# EAGLE design motor Controller4 (EAGLE 9.6.2)
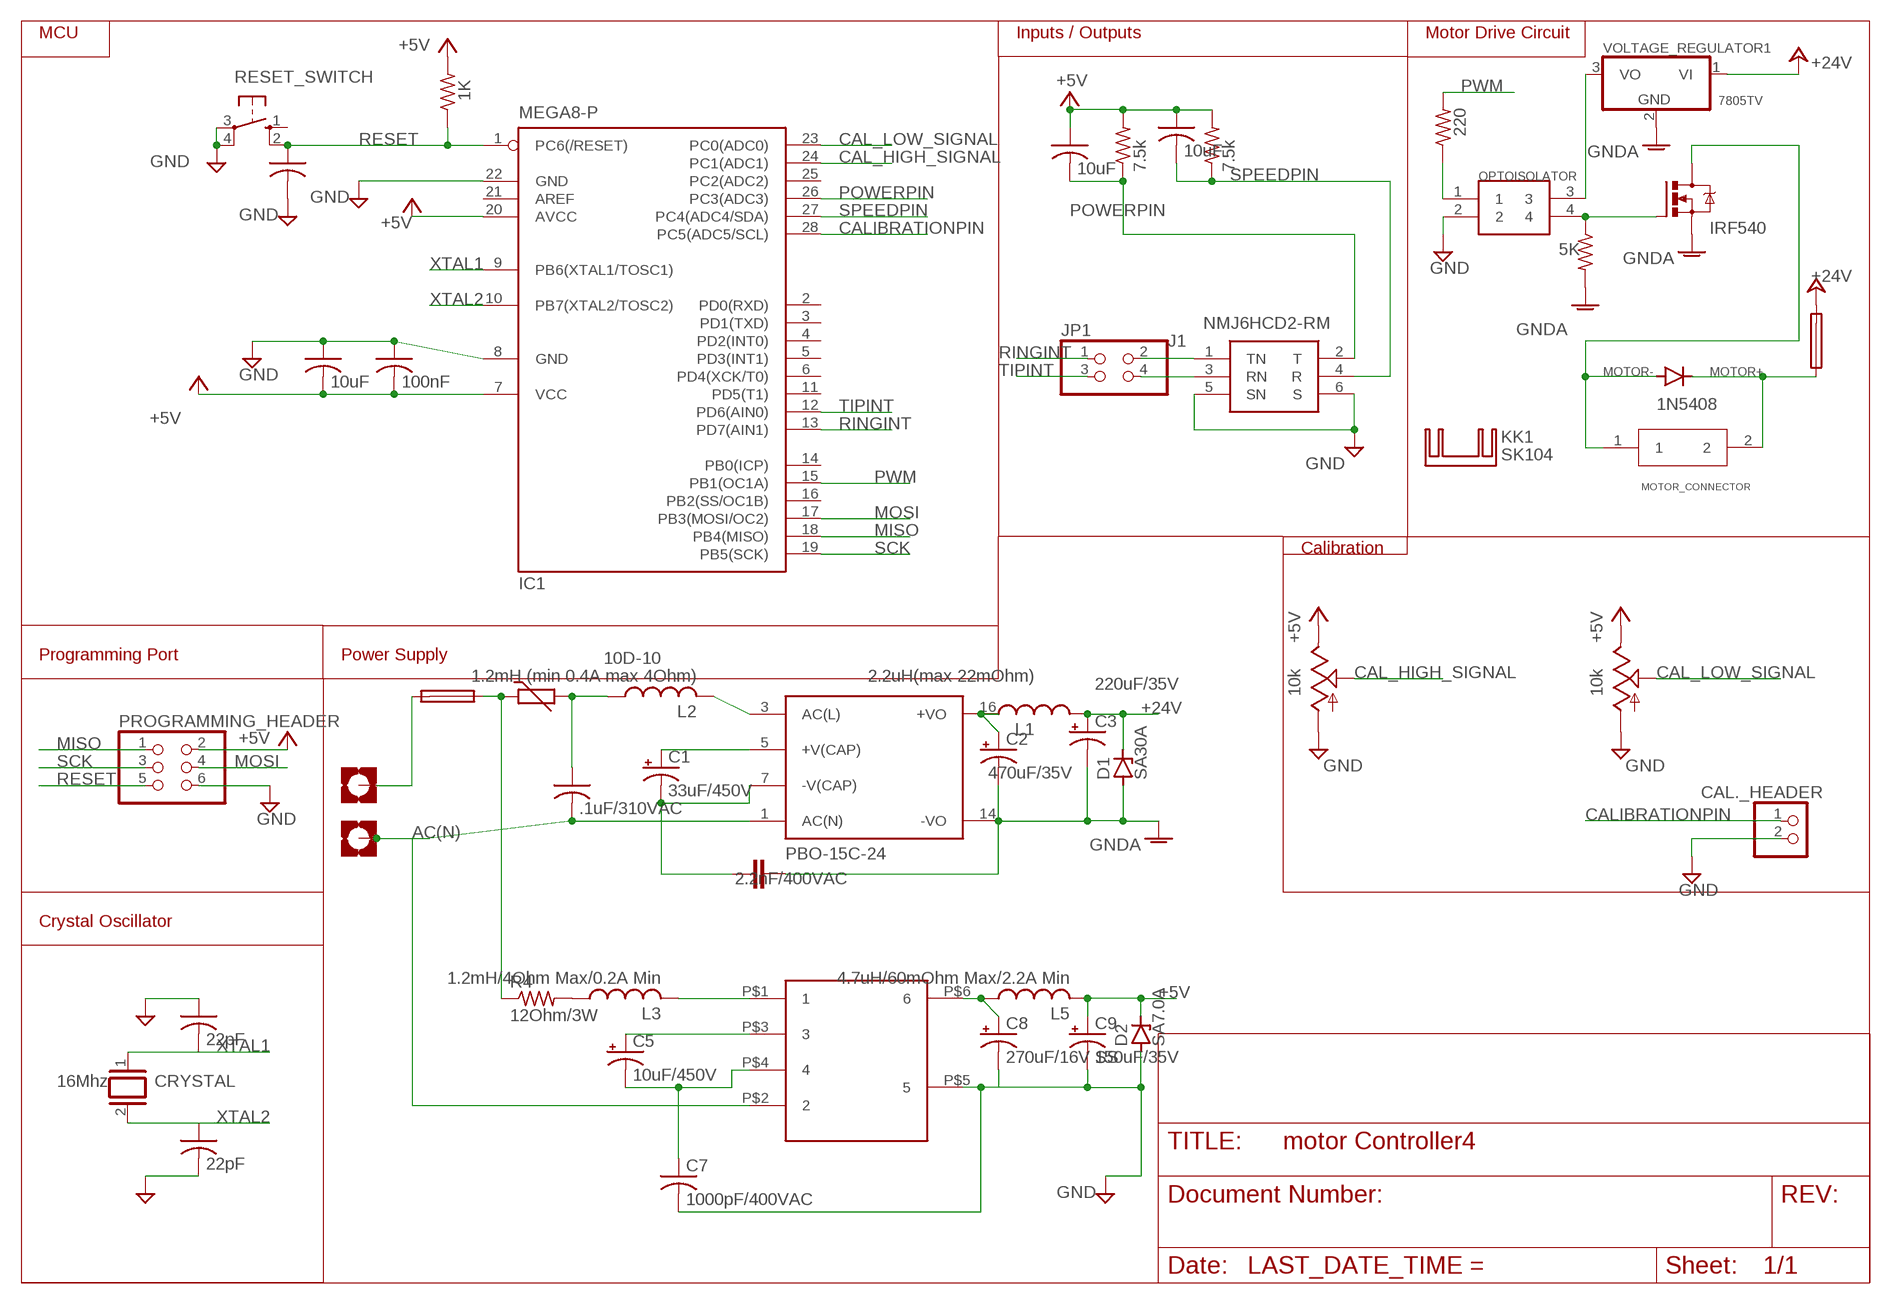
[diagram p0: schematic, sheet 1]

## Parts
1N5408  1N5408  1N5400  [DO201-15]
C1  33uF/450V  CPOL-USE5-13  [E5-13]
C2  470uF/35V  CPOL-USE5-10.5  [E5-10,5]
C3  220uF/35V  CPOL-USE5-10.5  [E5-10,5]
C4  .1uF/310VAC  C-US150-091X182  [C150-091X182]
C5  10uF/450V  CPOL-USE5-10.5  [E5-10,5]
C6  22pF  C-US025-024X044  [C025-024X044]
C7  1000pF/400VAC  C-US075-052X106  [C075-052X106]
C8  270uF/16V SS  CPOL-USE2.5-6  [E2,5-6]
C9  150uF/35V  CPOL-USE3.5-8  [E3,5-8]
C10  10uF  C-US025-024X044  [C025-024X044]
C11  C-US025-024X044  [C025-024X044]
C12  10uF  C-US025-024X044  [C025-024X044]
C13  10uF  C-US025-024X044  [C025-024X044]
C14  100nF  C-US025-024X044  [C025-024X044]
C15  22pF  C-US025-024X044  [C025-024X044]
CAL._HEADER  PINHD-1X2  [1X02]
CRYSTAL  16Mhz  XTAL/S  [QS]
CY1  2.2nF/400VAC  CYYC10B4  [YC10B4]
D1  SA30A  ZENER-DIODEZD-7.5  [ZDIO-7.5]
D2  SA7.0A  ZENER-DIODEZD-7.5  [ZDIO-7.5]
F1  FUSESH22,5  [SH22,5]
F2  1A/300V  FUSESH22,5  [SH22,5]
FAST  10k  TRIM_US-CT6  [CT6]
H1  MOUNT-PAD-SQUARE3.6  [3,6-PAD-SQUARE]
H2  MOUNT-PAD-SQUARE3.6  [3,6-PAD-SQUARE]
IC1  MEGA8-P  [DIL28-3]
J1  NMJ6HCD2-RM  [NMJ6HCD2RM]
JP1  PINHD-2X2  [2X02]
KK1  SK104  [SK104]
L1  2.2uH(max 22mOhm)  L-USTJ5-U1  [TJ5-U1]
L2  1.2mH (min 0.4A max 4Ohm)  L-US6000-XXX-RC  [6000-XXXX-RC]
L3  1.2mH/4Ohm Max/0.2A Min  L-US6000-XXX-RC  [6000-XXXX-RC]
L5  4.7uH/60mOhm Max/2.2A Min  L-US0207/2V  [0207/2V]
MOTOR_CONNECTOR  641963-1  [641963-1_TYC]
OPTOISOLATOR  SFH619A  SFH619A-ND  [SFH619A]
PROGRAMMING_HEADER  PINHD-2X3  [2X03]
PS1  PBO-15C-24  [CONV_PBO-15C-24]
Q1  IRF540  [TO220BV]
R1  10D-10  THERMISTOR-7,5  [R-7,5]
R2  1K  R-US_0204/7  [0204/7]
R3  7.5k  R-US_0204/7  [0204/7]
R4  12Ohm/3W  R-US_0617/22  [0617/22]
R5  220  R-US_0204/7  [0204/7]
R6  5K  R-US_0204/7  [0204/7]
R7  7.5k  R-US_0204/7  [0204/7]
RESET_SWITCH  10-XX  [B3F-10XX]
SLOW  10k  TRIM_US-CT6  [CT6]
U$1  L503-13B05R$3  [LS03-13BO5R3]
VOLTAGE_REGULATOR1  7805TV  [TO220V]

## Nets
+5V: C9.+ C10.1 C12.1 C13.2 C14.2 D2.C FAST.E IC1.7(VCC) IC1.20(AVCC) L5.2 PROGRAMMING_HEADER.2 R2.2 R3.2 R7.2 SLOW.E
+24V: C3.+ D1.C F1.2 L1.2 VOLTAGE_REGULATOR1.1(VI)
AC(L): L2.2 PS1.3(AC(L))
AC(N): C4.2 H2.B3,6(MOUNT) PS1.1(AC(N)) U$1.P$2
CAL_HIGH_SIGNAL: FAST.S IC1.24(PC1(ADC1))
CAL_LOW_SIGNAL: IC1.23(PC0(ADC0)) SLOW.S
CALIBRATIONPIN: CAL._HEADER.1 IC1.28(PC5(ADC5/SCL))
GND: C6.2 C7.2 C8.- C9.- C11.2 C13.1 C14.1 C15.1 CAL._HEADER.2 D2.A FAST.A IC1.8(GND) IC1.22(GND) J1.5(SN) J1.6(S) OPTOISOLATOR.2 PROGRAMMING_HEADER.6 RESET_SWITCH.3(P) RESET_SWITCH.4(P1) SLOW.A U$1.P$5
GNDA: C2.- C3.- CY1.1 D1.A PS1.14(-VO) Q1.S R6.2 VOLTAGE_REGULATOR1.2(GND)
MISO: IC1.18(PB4(MISO)) PROGRAMMING_HEADER.1
MOSI: IC1.17(PB3(MOSI/OC2)) PROGRAMMING_HEADER.4
MOTOR+: 1N5408.C F1.1 MOTOR_CONNECTOR.2
MOTOR-: 1N5408.A MOTOR_CONNECTOR.1 Q1.D
N$1: OPTOISOLATOR.1 R5.1
N$2: OPTOISOLATOR.4 Q1.G R6.1
N$3: OPTOISOLATOR.3 VOLTAGE_REGULATOR1.3(VO)
N$4: C2.+ L1.1 PS1.16(+VO)
N$5: C1.+ PS1.5(+V(CAP))
N$6: C1.- CY1.2 PS1.7(-V(CAP))
N$7: J1.1(TN) JP1.2
N$8: F2.2 H1.B3,6(MOUNT)
N$9: F2.1 R1.1 R4.1
N$10: C4.1 L2.1 R1.2
N$11: J1.3(RN) JP1.4
N$13: L3.1 R4.2
N$14: L3.2 U$1.P$1
N$15: C5.+ U$1.P$3
N$16: C5.- C7.1 U$1.P$4
N$17: C8.+ L5.1 U$1.P$6
POWERPIN: C10.2 IC1.26(PC3(ADC3)) J1.2(T) R3.1
PWM: IC1.15(PB1(OC1A)) R5.2
RESET: C11.1 IC1.1(PC6(/RESET)) PROGRAMMING_HEADER.5 R2.1 RESET_SWITCH.2(S1)
RINGINT: IC1.13(PD7(AIN1)) JP1.1
SCK: IC1.19(PB5(SCK)) PROGRAMMING_HEADER.3
SPEEDPIN: C12.2 IC1.27(PC4(ADC4/SDA)) J1.4(R) R7.1
TIPINT: IC1.12(PD6(AIN0)) JP1.3
XTAL1: C15.2 CRYSTAL.1 IC1.9(PB6(XTAL1/TOSC1))
XTAL2: C6.1 CRYSTAL.2 IC1.10(PB7(XTAL2/TOSC2))
Unconnected: IC1.2(PD0(RXD)) IC1.3(PD1(TXD)) IC1.4(PD2(INT0)) IC1.5(PD3(INT1)) IC1.6(PD4(XCK/T0)) IC1.11(PD5(T1)) IC1.14(PB0(ICP)) IC1.16(PB2(SS/OC1B)) IC1.21(AREF) IC1.25(PC2(ADC2)) RESET_SWITCH.1(S)

## Notes on the sheet
- MCU | Inputs / Outputs | Motor Drive Circuit
- Calibration
- Programming Port | Power Supply
- Crystal Oscillator

## Library data of the parts
1N5408 = diode:1N5400: DIODE standard rectifier, 3 A, 50 V (Motorola); MF: VISHAY; MPN: 1N5408-E3/54; OC_NEWARK: 05R6001
C1 C5 C8 C9 = rcl:CPOL-US: POLARIZED CAPACITOR, American symbol; OC_NEWARK: unknown; SPICEPREFIX: C
C2 = rcl:CPOL-US: POLARIZED CAPACITOR, American symbol; MF: PANASONIC; MPN: ECA1VHG471B; OC_NEWARK: 65AH6137; SPICEPREFIX: C
C3 = rcl:CPOL-US: POLARIZED CAPACITOR, American symbol; MF: KEMET; MPN: A768KS227M1VLAE024; OC_NEWARK: 92AH3968; SPICEPREFIX: C
C4 C6 C7 C10-C15 = rcl:C-US: CAPACITOR, American symbol; OC_NEWARK: unknown; SPICEPREFIX: C
CAL._HEADER = pinhead:PINHD-1X2: PIN HEADER; OC_NEWARK: unknown
CRYSTAL = special:XTAL/S: CRYSTAL; OC_NEWARK: unknown
CY1 = rcl:CY: Y CAPACITOR for power line; OC_NEWARK: unknown; SPICEPREFIX: C
D1 D2 = diode:ZENER-DIODE: Z-Diode; OC_NEWARK: unknown
F1 F2 = fuse:FUSE: Fuse; OC_FARNELL: unknown; OC_NEWARK: unknown
FAST SLOW = pot:TRIM_US-: POTENTIOMETER; OC_NEWARK: unknown
H1 H2 = holes:MOUNT-PAD-SQUARE: MOUNTING PAD, square; OC_NEWARK: unknown
IC1 = atmel:MEGA8-P: MICROCONTROLLER 8 Kbytes FLASH, 1 kbytes SRAM, 512 bytes EEPROM, USART, 4-channel 10 bit ADC, 2-channel 8 bit ADC Pin compatible with Atmega48, ATMega88, ATMega168 Source: avr.lbr; OC_FARNELL: unknown; OC_NEWARK: unknown
J1 = SamacSys_Parts:NMJ6HCD2-RM: NMJ6HCD2-RM Phone Connectors 1/4" STERO JCK SWTCH FULL TRD NSE PC HORZ Source: Datasheet <https://www.mouser.com/datasheet/2/289/st-nmj6hcd2-1842677.pdf>; DESCRIPTION: NMJ6HCD2-RM Phone Connectors 1/4" STERO JCK SWTCH FULL TRD NSE PC HORZ; HEIGHT: 15.67mm; MANUFACTURER_NAME: Neutrik; MANUFACTURER_PART_NUMBER: NMJ6HCD2-RM; MOUSER_PART_NUMBER: 568-NMJ6HCD2-RM; MOUSER_PRICE-STOCK: https://www.mouser.co.uk/ProductDetail/Neutrik/NMJ6HCD2-RM?qs=%252B86TLfaev28zLpqKj2fOGg%3D%3D; OC_NEWARK: unknown
JP1 = pinhead:PINHD-2X2: PIN HEADER; OC_NEWARK: unknown
KK1 = heatsink:SK104: HEATSINK manufacturer Fischer/distributor Buerklin; OC_NEWARK: unknown
L1-L3 L5 = rcl:L-US: INDUCTOR, American symbol; OC_NEWARK: unknown; SPICEPREFIX: L
MOTOR_CONNECTOR = Benson:641963-1; BUILT_BY: EMA_UL_Team; MANUFACTURER_PART_NUMBER: 641963-1; OC_NEWARK: unknown; SOURCELIBRARY: Tyco_2012-04-26; VENDOR: TE Connectivity
OPTOISOLATOR = Benson:SFH619A-ND; OC_NEWARK: unknown; OPTOISOLATOR: SFH619A
PROGRAMMING_HEADER = pinhead:PINHD-2X3: PIN HEADER; OC_NEWARK: unknown
PS1 = PBO-15C-24:PBO-15C-24: Check prices <https://pricing.snapeda.com/parts/PBO-15C-24/CUI%20Inc./view-part?ref=eda>; AVAILABILITY: Warning; CUI_PURCHASE_URL: https://www.cui.com/product/internal-ac-dc-power-supplies/board-mount/pbo-15c-series?utm_source=snapeda.com&utm_medium=referral&utm_campaign=snapedaBOM; DESCRIPTION: 15 W, 85 ~ 305 Vac Input, Single Output, Open Frame, Board Mount, Ac-Dc Power Supply; MF: CUI Inc.; MP: PBO-15C-24; OC_NEWARK: unknown; PACKAGE: None; PRICE: None; PURCHASE-URL: https://pricing.snapeda.com/search/part/PBO-15C-24/?ref=eda
Q1 = transistor-power:IRF540: HEXFET Power MOSFET; OC_NEWARK: unknown
R1 = varistor:THERMISTOR: THERMISTOR; OC_NEWARK: unknown
R2-R7 = rcl:R-US_: RESISTOR, American symbol; OC_NEWARK: unknown; SPICEPREFIX: R
RESET_SWITCH = switch-omron:10-XX: OMRON SWITCH; OC_FARNELL: 176432; OC_NEWARK: unknown
U$1 = MORNSUN 5V Isolated:L503-13B05R$3; OC_NEWARK: unknown
VOLTAGE_REGULATOR1 = linear:78*: Positive VOLTAGE REGULATOR Source: http://cache.national.com/ds/LM/LM78L05.pdf http://www.fairchildsemi.com/ds/LM/LM7805.pdf; OC_NEWARK: unknown

## Board
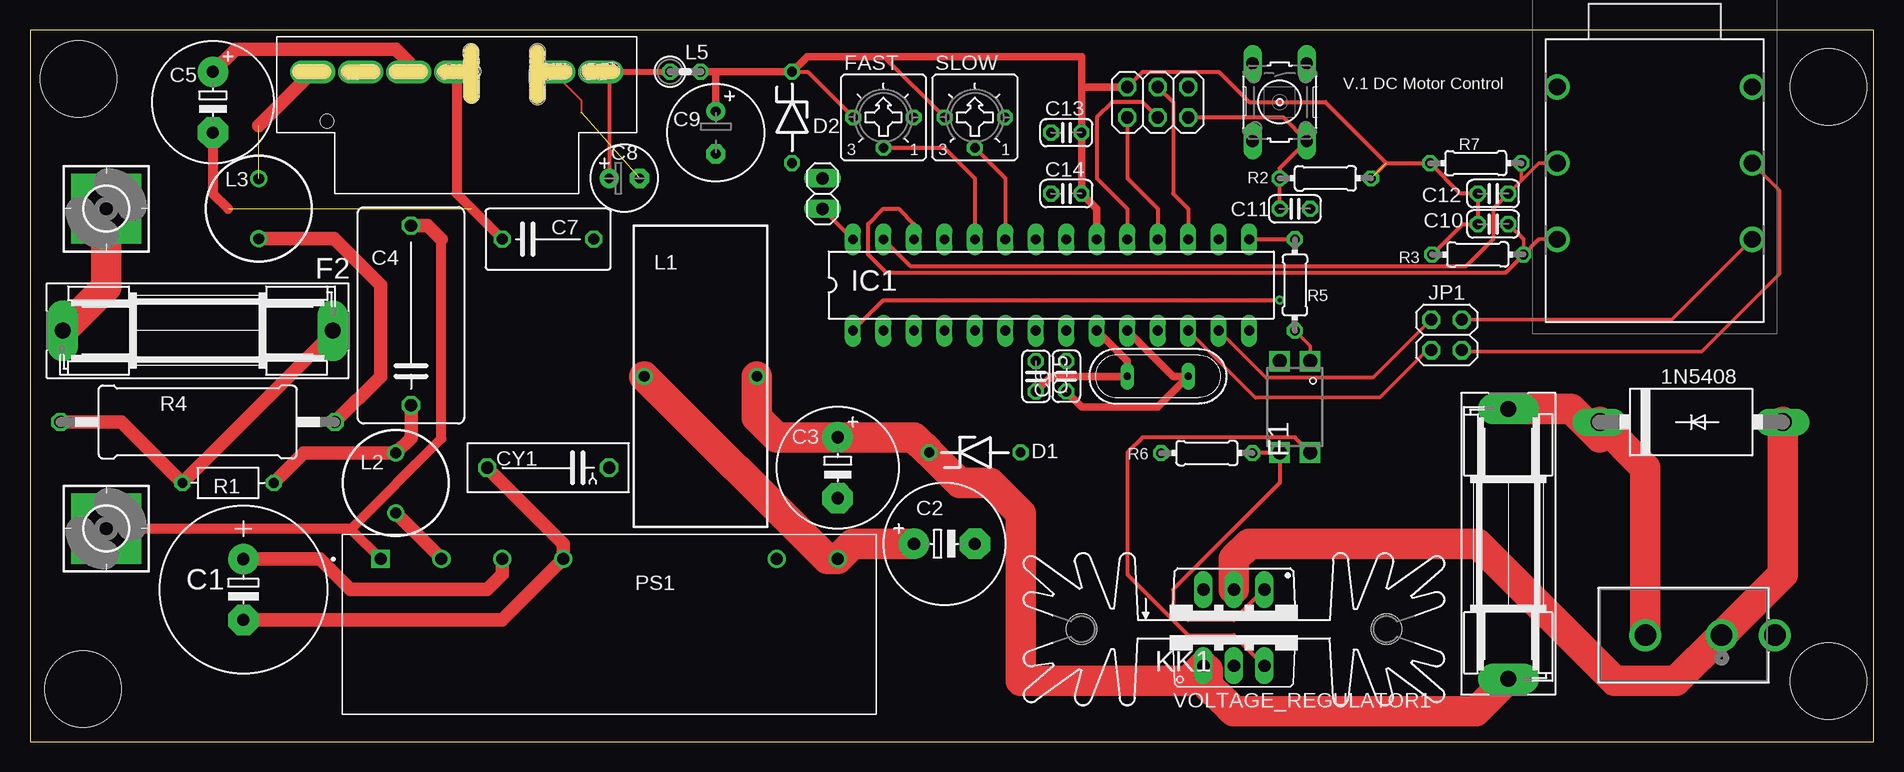
[diagram p1: board, top side]
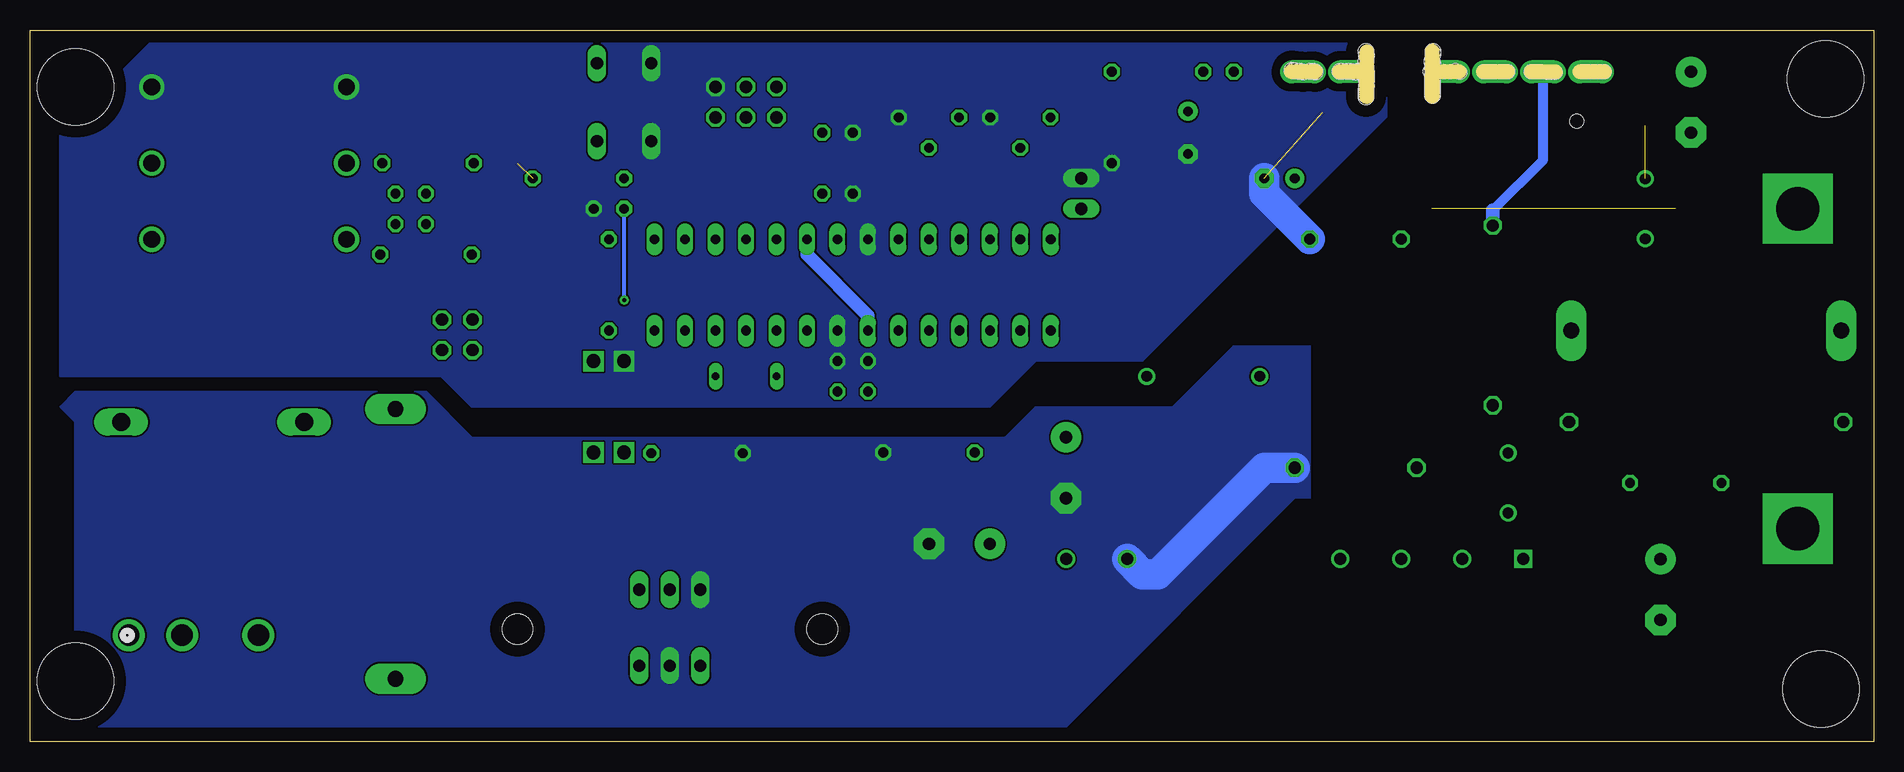
[diagram p2: board, bottom side, seen from below]

Size 153.65 x 59.36 mm. Coordinates in mm from the lower left corner, seen from the top.
Outline: 0,0 153.65,0 153.65,59.36 0,59.36 0,0
Copper layers (1*16): Top 0.035mm / dielectric 1.5mm / Bottom 0.035mm
Design rules "default *": minimum track width 6mil, minimum drill 0.35mm, track to track 6mil, track to pad 6mil, pad to pad 6mil, via to via 6mil, smd to smd 6mil, copper to edge 40mil, drill to drill 6mil, minimum pad ring 10mil, minimum via ring 8mil, stop-mask expansion 4mil, vias tented up to drill 0mil, thermal gap 0mil
Holes 6.35 mm at 149.86,54.61 149.86,5.08 4.03,55.29 4.4,4.4
Holes 1.14 mm at 24.75,51.77 22.46,55.87 22.81,55.89 23.17,55.89 23.47,55.89 23.82,55.87 24.05,55.87 24.12,55.87 24.32,55.87 24.35,55.87 26.54,55.84 26.91,55.84 27.22,55.84 27.67,55.87 27.84,55.87 28.1,55.87 28.17,55.87 28.35,55.87 28.45,55.87 28.55,55.87 30.51,55.89 30.69,55.89 30.86,55.89 31.16,55.89 31.57,55.89 31.77,55.89 31.94,55.89 32.07,55.89 32.27,55.89 32.32,55.89 32.47,55.89 32.52,55.89 34.51,55.82 34.89,55.97 35.29,55.87 35.79,55.87 36.32,55.89 36.55,55.92 36.72,55.92
Holes 1.27 mm at 36.75,57.55 36.75,57.35 36.8,56.77 36.8,56.67 36.75,56.47 36.9,55.89 36.77,56.15 36.77,55.62 36.77,55.29 36.77,55.06 36.77,54.84 36.77,54.71 36.77,54.46 36.77,54.36 36.77,54.11 36.77,53.93 36.77,53.91 42.31,57.55 42.28,57.25 42.31,56.75 42.31,56.25 42.26,55.87 42.26,55.54 42.26,55.42 42.26,55.11 42.28,54.71 42.31,54.33 42.31,54.13 42.31,53.96 42.31,53.78 42.58,55.94 42.89,55.94 43.06,55.87 43.26,55.87 43.67,55.89 43.72,55.89 43.92,55.89 44.29,55.92 44.5,55.92 46.56,55.87 46.68,55.89 46.99,55.89 47.56,55.87 47.79,55.89 47.89,55.89 48.19,55.94 48.34,55.94 48.49,55.97

### Footprints (pad centres in the part's own frame; a part is rotated, then mirrored left to right if it is on the bottom)
DO201-15 = drill 1.499 long: A 7.62,0; C -7.62,0
E5-13 = drill 1.016 pad 2.54: + -2.54,0 | drill 1.016 pad 2.54 octagon: - 2.54,0
E5-10,5 = drill 1.016 pad 2.54: + -2.54,0 | drill 1.016 pad 2.54 octagon: - 2.54,0
C150-091X182 = drill 1.016 octagon: 1 -7.493,0; 2 7.493,0
C025-024X044 = drill 0.813 octagon: 1 -1.27,0; 2 1.27,0
C075-052X106 = drill 0.914 octagon: 1 -3.81,0; 2 3.81,0
E2,5-6 = drill 0.813 pad 1.6: + -1.27,0 | drill 0.813 pad 1.6 octagon: - 1.27,0
E3,5-8 = drill 0.813 pad 1.6: + -1.778,0 | drill 0.813 pad 1.6 octagon: - 1.778,0
1X02 = drill 1.016 long: 1 -1.27,0; 2 1.27,0
QS = drill 0.61 long: 1 -2.54,0; 2 2.54,0
YC10B4 = drill 1.016 octagon: 1 -5.08,0; 2 5.08,0
ZDIO-7.5 = drill 0.813 octagon: A 3.81,0; C -3.81,0
SH22,5 = drill 1.321 pad 2.54 long: 1 -11.252,0; 2 11.252,0
CT6 = drill 0.813 octagon: A 2.515,0; E -2.515,0; S 0,-2.54
3,6-PAD-SQUARE = drill 3.6 pad 5.842 square: B3,6 0,0
DIL28-3 = drill 0.813 long: 1 -16.51,-3.81; 2 -13.97,-3.81; 3 -11.43,-3.81; 4 -8.89,-3.81; 5 -6.35,-3.81; 6 -3.81,-3.81; 7 -1.27,-3.81; 8 1.27,-3.81; 9 3.81,-3.81; 10 6.35,-3.81; 11 8.89,-3.81; 12 11.43,-3.81; 13 13.97,-3.81; 14 16.51,-3.81; 15 16.51,3.81; 16 13.97,3.81; 17 11.43,3.81; 18 8.89,3.81; 19 6.35,3.81; 20 3.81,3.81; 21 1.27,3.81; 22 -1.27,3.81; 23 -3.81,3.81; 24 -6.35,3.81; 25 -8.89,3.81; 26 -11.43,3.81; 27 -13.97,3.81; 28 -16.51,3.81
NMJ6HCD2RM = drill 1.4 pad 2.1: 1 0,0; 2 0,16.23; 3 6.35,0; 4 6.35,16.23; 5 12.7,0; 6 12.7,16.23
2X02 = drill 1.016 octagon: 1 -1.27,-1.27; 2 -1.27,1.27; 3 1.27,-1.27; 4 1.27,1.27
SK104 = hole 2.54: -12.7,-0.762; 12.7,-0.762
TJ5-U1 = drill 0.9: 1 -4.7,0; 2 4.7,0
6000-XXXX-RC = drill 0.9 pad 1.422: 1 -2.5,0; 2 2.5,0
0207/2V = drill 0.813 octagon: 1 -1.27,0; 2 1.27,0
641963-1_TYC = drill 1.778 pad 2.286: 1 0,0; 2 6.35,0; 3 -4.445,0
SFH619A = drill 1.143 square: 1 -3.81,1.27; 2 -3.81,-1.27; 3 3.81,1.27; 4 3.81,-1.27
2X03 = drill 1.016 octagon: 1 -2.54,-1.27; 2 -2.54,1.27; 3 0,-1.27; 4 0,1.27; 5 2.54,-1.27; 6 2.54,1.27
CONV_PBO-15C-24 = drill 1 square: 1 -19.05,0 | drill 1: 3 -13.97,0; 5 -8.89,0; 7 -3.81,0; 14 13.97,0; 16 19.05,0
TO220BV = drill 1.016 long: D 0,-2.54; G -2.54,-2.54; S 2.54,-2.54
R-7,5 = drill 0.813 octagon: 1 -3.81,0; 2 3.81,0
0204/7 = drill 0.813 octagon: 1 -3.81,0; 2 3.81,0
0617/22 = drill 1.016 octagon: 1 -11.43,0; 2 11.43,0
B3F-10XX = drill 1.016 long: 1 -3.251,2.261; 2 3.251,2.261; 3 -3.251,-2.261; 4 3.251,-2.261
LS03-13BO5R3 = drill 1.2 pad 1.9 long: P$1 -12,5.08; P$2 -8,5.08; P$3 -4,5.08; P$4 0,5.08; P$5 8,5.08; P$6 12,5.08
TO220V = drill 1.016 long: 1 -2.54,-2.54; 2 0,-2.54; 3 2.54,-2.54

### Placement (x,y rotation side)
1N5408  138.43,26.67 0 top
C1  17.78,12.7 270 top
C2  76.2,16.51 0 top
C3  67.31,22.86 270 top
C4  31.75,35.56 90 top
C5  15.24,53.34 270 top
C6  86.36,30.48 90 top
C7  43.18,41.91 0 top
C8  49.53,46.99 0 top
C9  57.15,50.8 270 top
C10  121.92,43.18 0 top
C11  105.41,44.45 0 top
C12  121.92,45.72 0 top
C13  86.36,50.8 0 top
C14  86.36,45.72 0 top
C15  83.82,30.48 270 top
CAL._HEADER  66.04,45.72 90 top
CRYSTAL  93.98,30.48 0 top
CY1  43.18,22.86 180 top
D1  78.74,24.13 0 top
D2  63.5,52.07 270 top
F1  123.19,16.51 270 top
F2  13.97,34.29 180 top
FAST  71.12,52.07 0 top
H1  6.35,44.45 0 top
H2  6.35,17.78 0 top
IC1  85.09,38.1 0 top
J1  143.51,41.91 90 top
JP1  118.05,33.93 270 top
KK1  100.33,10.16 0 top
L1  55.88,30.48 0 top
L2  30.48,21.59 270 top
L3  19.05,44.45 90 top
L5  54.61,55.88 0 top
MOTOR_CONNECTOR  140.97,8.89 180 top
OPTOISOLATOR  105.41,27.94 270 top
PROGRAMMING_HEADER  93.98,53.34 0 top
PS1  48.26,15.24 0 top
Q1  100.33,10.16 180 top
R1  16.51,21.59 0 top
R2  107.95,46.99 0 top
R3  120.65,40.64 180 top
R4  13.97,26.67 0 top
R5  105.41,38.1 90 top
R6  98.07,24.08 180 top
R7  120.48,48.26 180 top
RESET_SWITCH  104.14,53.34 270 top
SLOW  78.74,52.07 0 top
U$1  35.56,50.8 0 top
VOLTAGE_REGULATOR1  100.33,8.89 0 top

### Tracks (layer width: path | path; a pad name or v marks a point on that pad's centre or on a via)
+5V  (1 unrouted)
  Top 0.318: D2.C 64.8,55.88 FAST.E | 69.85,57.15 71.14,57.15 SLOW.E | R3.2 119.38,43.18 C10.1 C12.1 119.2,45.72 R7.2 113.03,48.26 R2.2 | PROGRAMMING_HEADER.2 92.71,55.88 99.06,55.88 101.6,53.34 107.95,53.34 113.03,48.26
  Top 0.635: L5.2 57.15,55.88 | 57.15,55.88 D2.C 64.77,57.15 69.85,57.15 87.63,57.15 87.63,54.61 | 57.15,55.88 C9.+ | 87.63,54.61 PROGRAMMING_HEADER.2 | 87.63,54.61 C13.2 C14.2 88.9,44.45 IC1.20
  Bottom 1.143: IC1.20 88.9,40.64 83.82,35.56 IC1.7
+24V
  Top 2.54: L1.2 60.58,27.05 62.23,25.4 C3.+ 73.66,25.4 D1.C 77.47,21.59 80.01,21.59 82.55,19.05 82.55,5.08 96.52,5.08 VOLTAGE_REGULATOR1.1 98.15,5.99 98.15,4.68 99.42,3.4 99.47,3.4 100.33,2.54 120.47,2.54 F1.2
AC(L)
  Top 1.143: L2.2 34.29,15.28 PS1.3
AC(N)
  Top 0.813: H2.B3,6 26.67,17.78 26.72,17.73 | 26.72,17.73 PS1.1 | 26.72,17.73 34.29,25.29 34.29,41.91
  Top 1.143: 34.29,41.91 33.15,43.05 C4.2
  Bottom 0.813: 31.75,44.32 27.56,48.51 U$1.P$2
  Bottom 1.143: 31.75,44.32 C4.2
CAL_HIGH_SIGNAL
  Top 0.318: FAST.S 76.2,49.53 78.74,46.99 IC1.24
CAL_LOW_SIGNAL
  Top 0.318: SLOW.S 81.28,46.99 IC1.23
CALIBRATIONPIN
  Top 0.318: CAL._HEADER.1 IC1.28
GND  (1 unrouted)
  Top 0.152: U$1.P$5 45.93,53.51 45.93,52.49
  Bottom 2.54: C7.2 50.8,45.72 C8.-
  pour Bottom: 40.64,58.49 40.64,52.07 60.96,31.75 69.85,31.75 73.66,27.94 116.84,27.94 119.38,30.48 151.13,30.48 151.13,50.8 143.44,58.49
GNDA
  Bottom 0.318: 60.96,15.24 PS1.14
  Bottom 2.54: PS1.14 60.96,13.97 59.69,13.97 50.8,22.86 CY1.1
  pour Bottom: 151.13,27.94 149.86,29.21 120.65,29.21 116.84,25.4 72.39,25.4 69.85,27.94 58.42,27.94 53.34,33.02 46.99,33.02 46.99,20.32 48.26,20.32 67.31,1.27 148.59,1.27 149.86,2.54 149.86,26.67
MISO
  Top 0.318: PROGRAMMING_HEADER.1 91.44,46.99 93.98,44.45 IC1.18
MOSI
  Top 0.318: PROGRAMMING_HEADER.4 95.25,53.34 95.25,45.72 96.52,44.45 IC1.17
MOTOR+
  Top 2.54: F1.1 128.45,27.76 130.81,25.4 1N5408.C 134.62,22.86 MOTOR_CONNECTOR.2
MOTOR-
  Top 2.54: 1N5408.A 146.05,13.97 MOTOR_CONNECTOR.1 137.16,5.08 132.08,5.08 120.65,16.51 101.6,16.51 100.33,15.24 Q1.D
N$1
  Top 0.305: R5.1 106.68,33.02 OPTOISOLATOR.1
N$2
  Top 0.305: 96.52,10.16 100.33,10.16
  Top 0.318: R6.1 104.09,24.08 OPTOISOLATOR.4 104.14,21.59 95.25,12.7 95.25,11.43 96.52,10.16 | 100.33,10.16 Q1.G
N$3
  Top 0.318: OPTOISOLATOR.3 105.41,25.4 92.71,25.4 91.44,24.13 91.44,13.97 96.52,8.89 100.33,8.89 VOLTAGE_REGULATOR1.3
N$4
  Top 2.54: C2.+ 68.58,16.51 PS1.16 66.42,15.24 L1.1
N$5
  Top 1.143: C1.+ 24.13,15.24 26.67,12.7 38.1,12.7 39.37,13.97 PS1.5
N$6
  Top 1.143: CY1.2 44.45,16.51 PS1.7 39.37,10.16 C1.-
N$7
  Top 0.305: J1.1 136.8,35.2 JP1.2
N$8
  Top 2.54: H1.B3,6 6.35,37.92 F2.2
N$9
  Top 1.143: F2.1 25.22,34.11 R1.1 7.62,26.67 R4.1
N$10
  Top 1.143: C4.1 31.75,25.36 L2.1 22.82,24.09 R1.2
N$11
  Top 0.305: J1.3 145.79,45.98 145.79,39.04 139.32,32.56 119.42,32.56 JP1.4
N$13
  Top 1.143: R4.2 29.21,30.48 29.21,38.1 25.36,41.95 L3.1
N$14  (1 unrouted)
  Top 1.143: 19.05,51.37 U$1.P$1
N$15
  Top 1.143: C5.+ 17.13,57.77 30.48,57.77 31.56,56.69 U$1.P$3
N$16  (1 unrouted)
  Top 0.813: C5.- 15.24,45.72 16.51,44.45 | 36.83,44.45 C7.1 35.56,45.72 U$1.P$4
N$17
  Top 0.318: 48.26,55.88 C8.+
  Top 0.508: U$1.P$6 48.26,55.88 L5.1
POWERPIN
  Top 0.305: 124.46,41.91 R3.1 | 125.73,41.91 J1.2
  Top 0.318: 125.73,41.91 R3.1 122.96,39.14 71.35,39.14 69.85,40.64 69.85,43.18 71.12,44.45 72.39,44.45 73.66,43.18 IC1.26 | C10.2 124.46,41.91
PWM
  Top 0.318: IC1.15 R5.2
RESET  (via drill 0.35)
  Top 0.318: PROGRAMMING_HEADER.5 104.42,52.07 RESET_SWITCH.2 104.14,47.83 R2.1 C11.1 | IC1.1 71.12,36.83 v104.14,36.83
  Bottom 0.318: v104.14,36.83 C11.1
RINGINT
  Top 0.305: IC1.13 102.98,30.37 111.95,30.37 JP1.1
SCK
  Top 0.318: PROGRAMMING_HEADER.3 92.71,53.34 90.17,53.34 88.9,52.07 88.9,46.99 91.44,44.45 IC1.19
SPEEDPIN
  Top 0.305: C12.2 124.29,46.82 | 124.29,46.82 R7.1 | 124.29,46.82 125.73,48.26 J1.4
  Top 0.318: C12.2 121.92,44.45 121.92,41.91 119.64,39.63 73.4,39.63 IC1.27
TIPINT
  Top 0.305: IC1.12 102.1,28.71 | 102.1,28.71 102.13,28.68 | 102.1,28.71 112.5,28.71 116.45,32.66 JP1.3
XTAL1
  Top 0.635: IC1.9 91.44,31.75 CRYSTAL.1 85.09,30.48 C15.2
XTAL2
  Top 0.635: IC1.10 95.25,30.48 CRYSTAL.2 93.98,27.94 87.63,27.94 C6.1

### Text on the board
tNames: V.1 DC Motor Control